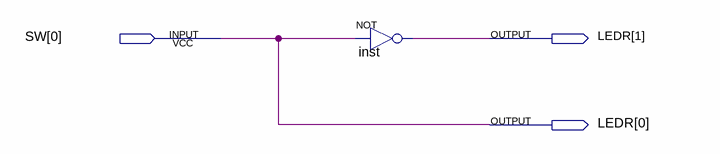
[diagram p0: schematic sheet]
// Quartus schematic myFirstDesign.bdf as structural Verilog: 1 symbols, 3 pins
module myFirstDesign (
  input  [0:0] SW,
  output [1:0] LEDR
);

  not inst (LEDR[1], SW[0]);

  assign LEDR[0] = SW[0];
endmodule
